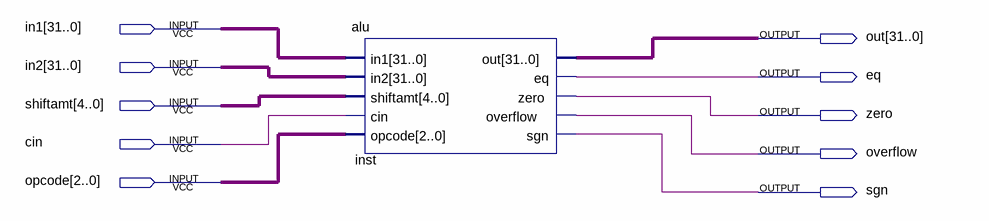
[diagram p0: schematic sheet]
// Quartus schematic Alu-test.bdf as structural Verilog: 1 symbols, 10 pins
module \Alu-test  (
  input  [31:0] in1,
  input  [31:0] in2,
  input  [4:0] shiftamt,
  input  cin,
  input  [2:0] opcode,
  output [31:0] out,
  output eq,
  output zero,
  output overflow,
  output sgn
);

  alu inst (
    .in1(in1), .in2(in2), .shiftamt(shiftamt), .cin(cin), .opcode(opcode), .out(out), .eq(eq), .zero(zero),
    .overflow(overflow), .sgn(sgn));
endmodule
